# EAGLE design pc_kalam_ads1220_cap (EAGLE 6.4)
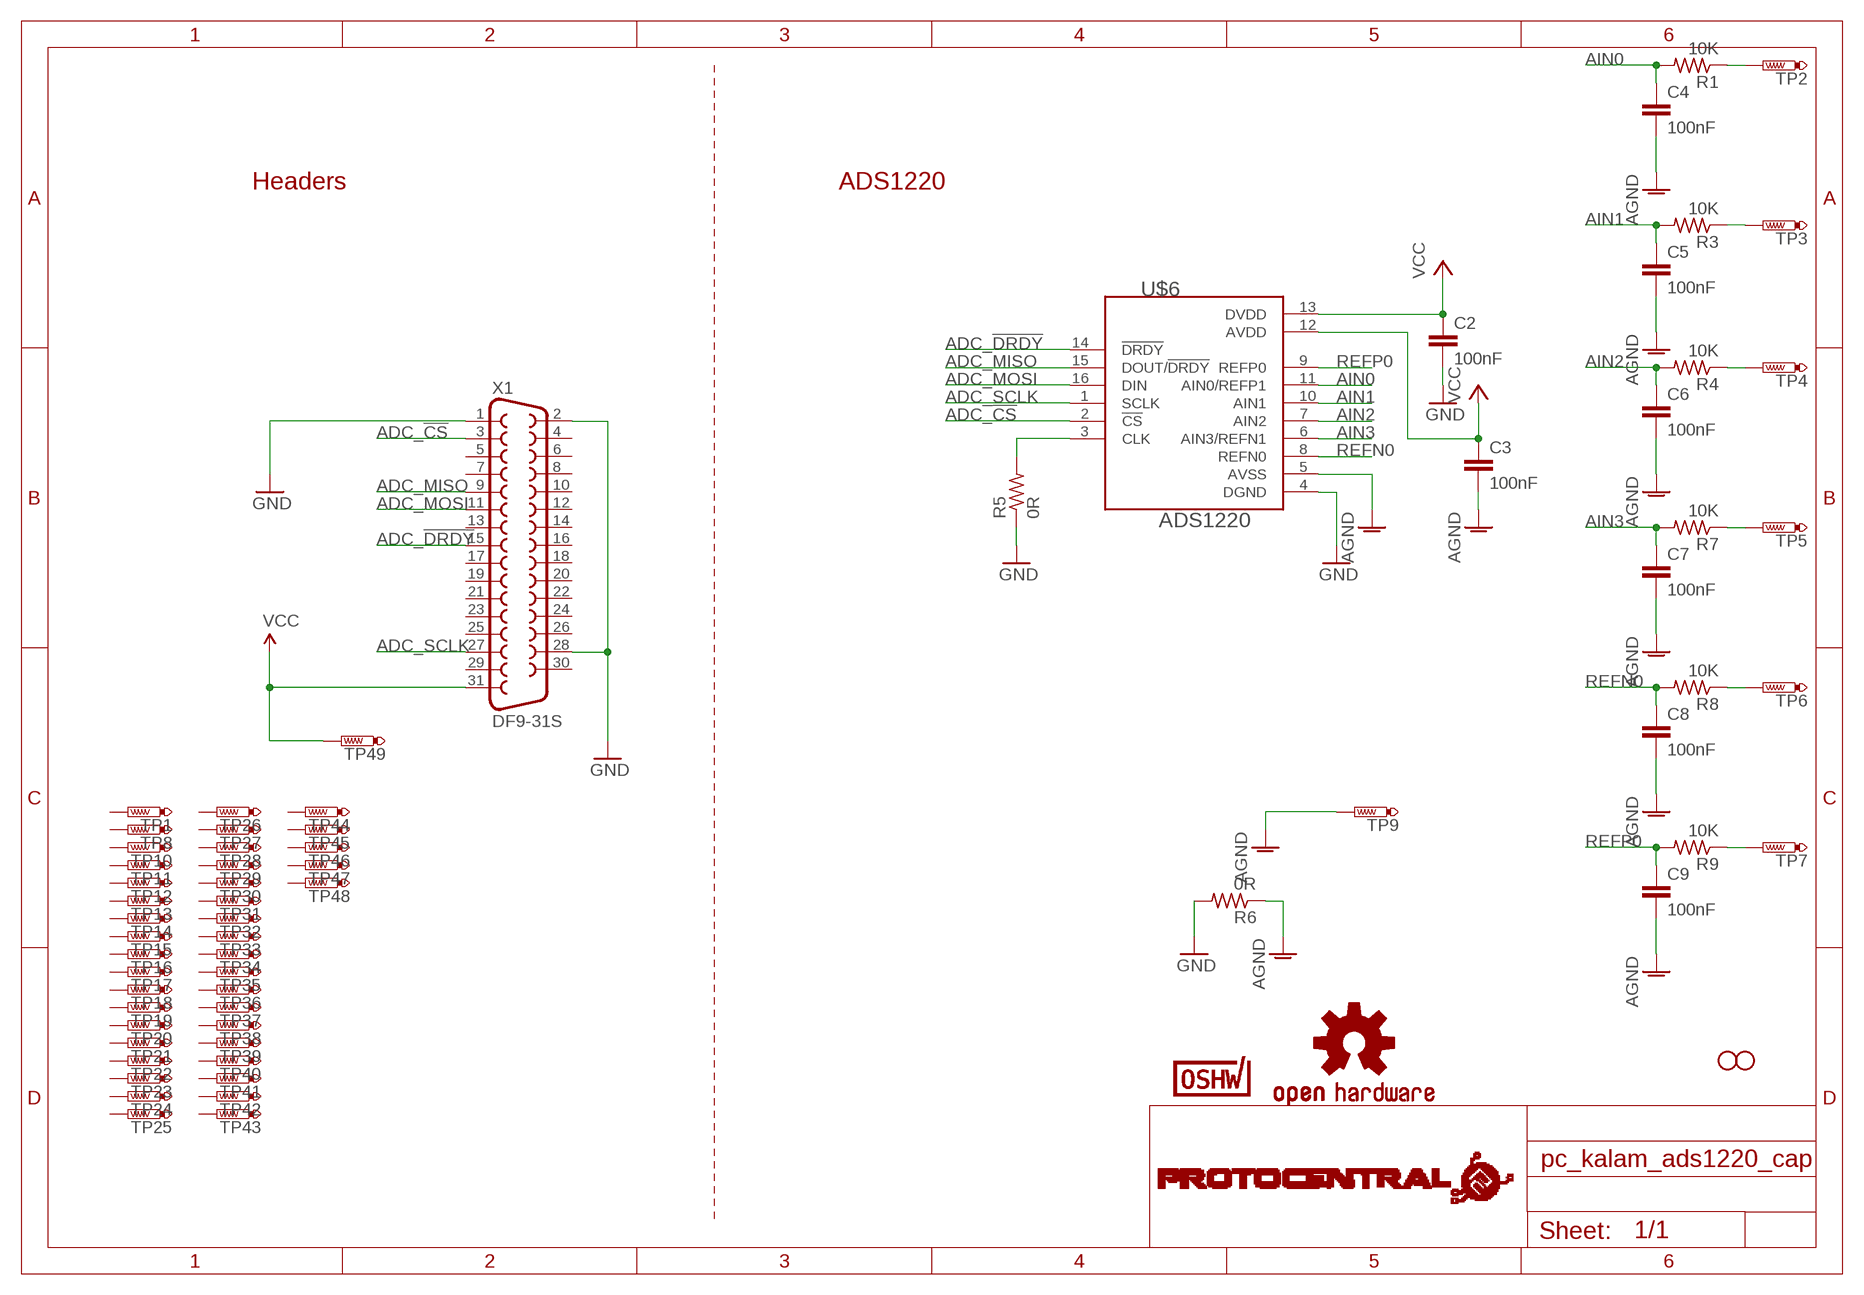
[diagram p0: schematic, sheet 1]

## Parts
C2  100nF  C-EUC0805  [C0805]
C3  100nF  C-EUC0805  [C0805]
C4  100nF  C-EUC0805  [C0805]
C5  100nF  C-EUC0805  [C0805]
C6  100nF  C-EUC0805  [C0805]
C7  100nF  C-EUC0805  [C0805]
C8  100nF  C-EUC0805  [C0805]
C9  100nF  C-EUC0805  [C0805]
R1  10K  R-US_R0805  [R0805]
R3  10K  R-US_R0805  [R0805]
R4  10K  R-US_R0805  [R0805]
R5  0R  R-US_R0805  [R0805]
R6  0R  R-US_R0805  [R0805]
R7  10K  R-US_R0805  [R0805]
R8  10K  R-US_R0805  [R0805]
R9  10K  R-US_R0805  [R0805]
STANDOFF7  STAND-OFF  [STAND-OFF]
STANDOFF8  STAND-OFF  [STAND-OFF]
TP1  PTR1PAD1-13  [P1-13]
TP2  PTR1PAD1-13  [P1-13]
TP3  PTR1PAD1-13  [P1-13]
TP4  PTR1PAD1-13  [P1-13]
TP5  PTR1PAD1-13  [P1-13]
TP6  PTR1PAD1-13  [P1-13]
TP7  PTR1PAD1-13  [P1-13]
TP8  PTR1PAD1-13  [P1-13]
TP9  PTR1PAD1-13  [P1-13]
TP10  PTR1PAD1-13  [P1-13]
TP11  PTR1PAD1-13  [P1-13]
TP12  PTR1PAD1-13  [P1-13]
TP13  PTR1PAD1-13  [P1-13]
TP14  PTR1PAD1-13  [P1-13]
TP15  PTR1PAD1-13  [P1-13]
TP16  PTR1PAD1-13  [P1-13]
TP17  PTR1PAD1-13  [P1-13]
TP18  PTR1PAD1-13  [P1-13]
TP19  PTR1PAD1-13  [P1-13]
TP20  PTR1PAD1-13  [P1-13]
TP21  PTR1PAD1-13  [P1-13]
TP22  PTR1PAD1-13  [P1-13]
TP23  PTR1PAD1-13  [P1-13]
TP24  PTR1PAD1-13  [P1-13]
TP25  PTR1PAD1-13  [P1-13]
TP26  PTR1PAD1-13  [P1-13]
TP27  PTR1PAD1-13  [P1-13]
TP28  PTR1PAD1-13  [P1-13]
TP29  PTR1PAD1-13  [P1-13]
TP30  PTR1PAD1-13  [P1-13]
TP31  PTR1PAD1-13  [P1-13]
TP32  PTR1PAD1-13  [P1-13]
TP33  PTR1PAD1-13  [P1-13]
TP34  PTR1PAD1-13  [P1-13]
TP35  PTR1PAD1-13  [P1-13]
TP36  PTR1PAD1-13  [P1-13]
TP37  PTR1PAD1-13  [P1-13]
TP38  PTR1PAD1-13  [P1-13]
TP39  PTR1PAD1-13  [P1-13]
TP40  PTR1PAD1-13  [P1-13]
TP41  PTR1PAD1-13  [P1-13]
TP42  PTR1PAD1-13  [P1-13]
TP43  PTR1PAD1-13  [P1-13]
TP44  PTR1PAD1-13  [P1-13]
TP45  PTR1PAD1-13  [P1-13]
TP46  PTR1PAD1-13  [P1-13]
TP47  PTR1PAD1-13  [P1-13]
TP48  PTR1PAD1-13  [P1-13]
TP49  PTR1PAD1-13  [P1-13]
U$1  PROTY-LOGO  [LOGO-PROTY]
U$2  CERT-SMALL  [CERT-SMALL-SILK]
U$3  OSHW-LOGOS  [OSHW-LOGO-S]
U$6  ADS1220  [TSSOP-16]
X1  DF9-31S  [DF9-31S]

## Nets
ADC_!CS: U$6.2(!CS) X1.3
ADC_!DRDY: U$6.14(!DRDY) X1.15
ADC_CLK: R5.2 U$6.3(CLK)
ADC_MISO: U$6.15(DOUT/!DRDY) X1.9
ADC_MOSI: U$6.16(DIN) X1.11
ADC_SCLK: U$6.1(SCLK) X1.27
AGND: C3.2 C4.2 C5.2 C6.2 C7.2 C8.2 C9.2 R6.1 TP9.TP U$6.5(AVSS)
AIN0: C4.1 R1.2 U$6.11(AIN0/REFP1)
AIN1: C5.1 R3.2 U$6.10(AIN1)
AIN2: C6.1 R4.2 U$6.7(AIN2)
AIN3: C7.1 R7.2 U$6.6(AIN3/REFN1)
GND: C2.2 R5.1 R6.2 U$6.4(DGND) X1.1 X1.2 X1.28
N$2: R1.1 TP2.TP
N$3: R3.1 TP3.TP
N$4: R4.1 TP4.TP
N$5: R7.1 TP5.TP
N$6: R8.1 TP6.TP
N$7: R9.1 TP7.TP
REFN0: C8.1 R8.2 U$6.8(REFN0)
REFP0: C9.1 R9.2 U$6.9(REFP0)
VCC: C2.1 C3.1 TP49.TP U$6.12(AVDD) U$6.13(DVDD) X1.31
Unconnected: TP1.TP TP8.TP TP10.TP TP11.TP TP12.TP TP13.TP TP14.TP TP15.TP TP16.TP TP17.TP TP18.TP TP19.TP TP20.TP TP21.TP TP22.TP TP23.TP TP24.TP TP25.TP TP26.TP TP27.TP TP28.TP TP29.TP TP30.TP TP31.TP TP32.TP TP33.TP TP34.TP TP35.TP TP36.TP TP37.TP TP38.TP TP39.TP TP40.TP TP41.TP TP42.TP TP43.TP TP44.TP TP45.TP TP46.TP TP47.TP TP48.TP X1.4 X1.5 X1.6 X1.7 X1.8 X1.10 X1.12 X1.13 X1.14 X1.16 X1.17 X1.18 X1.19 X1.20 X1.21 X1.22 X1.23 X1.24 X1.25 X1.26 X1.29 X1.30

## Notes on the sheet
- Headers | ADS1220

## Library data of the parts
C2-C9 = rcl:C-EU: CAPACITOR, European symbol
R1 R3-R9 = rcl:R-US_: RESISTOR, American symbol
STANDOFF7 STANDOFF8 = SparkFun-Electromechanical:STAND-OFF: #4 Stand Off This is the mechanical footprint for a #4 phillips button head screw. Use the keepout ring to avoid running the screw head into surrounding components. SKU : PRT-00447
TP1-TP49 = testpad:PTR1: TEST PIN
U$1 = circuitects:PROTY-LOGO
U$2 = OSHWA:CERT
U$3 = SparkFun:OSHW-LOGO: Open Source Hardware Logo This logo indicates the piece of hardware it is found on incorporates a OSHW license and/or adheres to the definition of open source hardware found here: http://freedomdefined.org/OSHW
U$6 = circuitects:ADS1220
X1 = con-hirose:DF9-31S: SMD CONNECTOR Source: con-hirose.lbr from Bob Starr <rtzaudio@mindspring.com>; MPN: DF9-31S-1V(32); OC_FARNELL: 1798382; OC_NEWARK: 74R3383

## Board
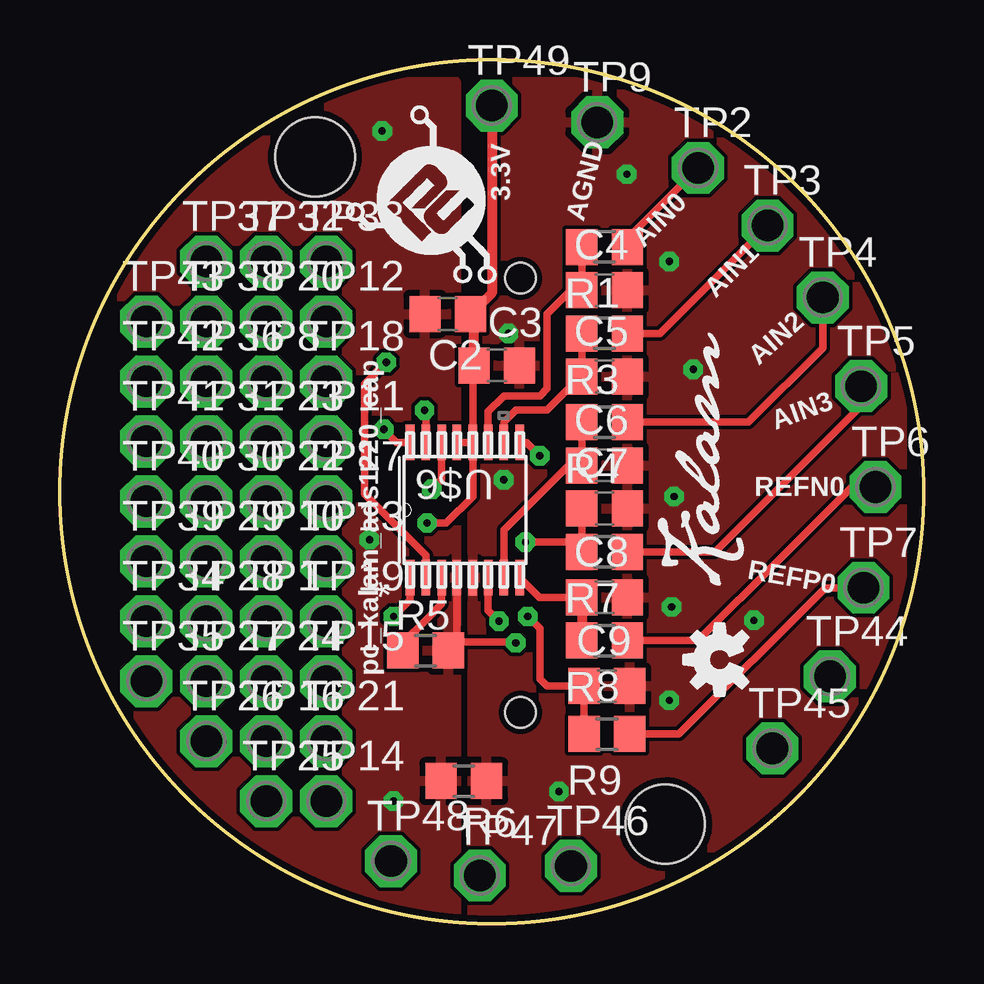
[diagram p1: board, top side]
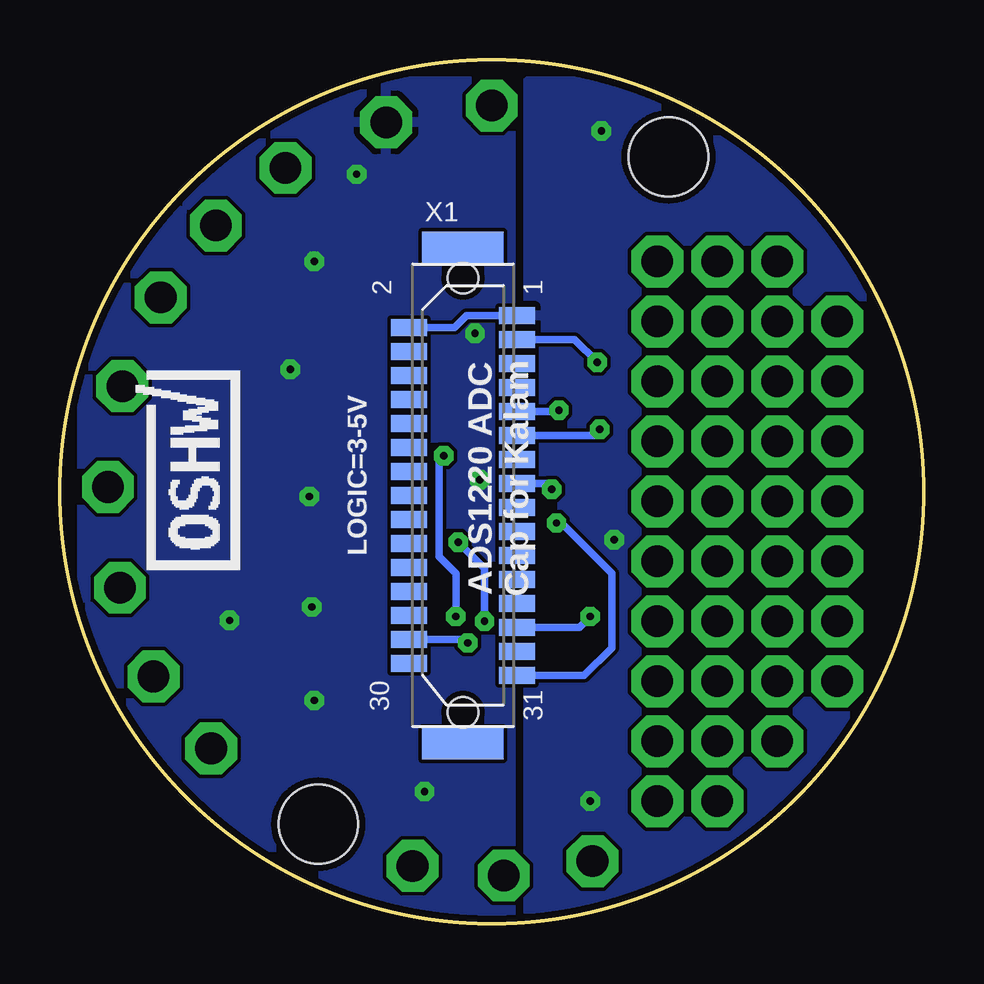
[diagram p2: board, bottom side, seen from below]

Size 36 x 36 mm. Coordinates in mm from the lower left corner, seen from the top.
Outline: circle at 18,18 radius 18
Copper layers (1*2*15*16): Top 0.035mm / dielectric 1.5mm / Route2 0.035mm / dielectric 0.15mm / Route15 0.035mm / dielectric 0.2mm / Bottom 0.035mm
Design rules "Circuitects-Rules": minimum track width 6mil, minimum drill 0.3mm, track to track 6mil, track to pad 6mil, pad to pad 6mil, via to via 6mil, smd to smd 6mil, copper to edge 10mil, drill to drill 8mil, minimum pad ring 12mil, minimum via ring 10mil, stop-mask expansion 4mil, vias tented up to drill 25mil, thermal gap 10mil

### Footprints (pad centres in the part's own frame; a part is rotated, then mirrored left to right if it is on the bottom)
C0805 = smd 1.3 x 1.5: 1 -0.95,0; 2 0.95,0
R0805 = smd 1.3 x 1.5: 1 -0.95,0; 2 0.95,0
STAND-OFF = hole 3.302: 0,0
P1-13 = drill 1.321 pad 2.159 octagon: TP 0,0
TSSOP-16 = smd 1.473 x 0.356: 1 -2.819,2.256; 2 -2.819,1.596; 3 -2.819,0.935; 4 -2.819,0.3; 5 -2.819,-0.36; 6 -2.819,-0.995; 7 -2.819,-1.656; 8 -2.819,-2.316; 9 2.819,-2.316; 10 2.819,-1.656; 11 2.819,-0.995; 12 2.819,-0.36; 13 2.819,0.3; 14 2.819,0.935; 15 2.819,1.596; 16 2.819,2.256
DF9-31S = smd 0.7 x 1.5: 1 -7.5,2.25; 2 -7,-2.25; 3 -6.5,2.25; 4 -6,-2.25; 5 -5.5,2.25; 6 -5,-2.25; 7 -4.5,2.25; 8 -4,-2.25; 9 -3.5,2.25; 10 -3,-2.25; 11 -2.5,2.25; 12 -2,-2.25; 13 -1.5,2.25; 14 -1,-2.25; 15 -0.5,2.25; 16 0,-2.25; 17 0.5,2.25; 18 1,-2.25; 19 1.5,2.25; 20 2,-2.25; 21 2.5,2.25; 22 3,-2.25; 23 3.5,2.25; 24 4,-2.25; 25 4.5,2.25; 26 5,-2.25; 27 5.5,2.25; 28 6,-2.25; 29 6.5,2.25; 30 7,-2.25; 31 7.5,2.25 | smd 1.3 x 3.4: M1 -10.35,0; M2 10.35,0 | hole 1.27: 9.05,0; -9.05,0

### Placement (x,y rotation side)
C2  16.17,25.41 180 top
C3  18.21,23.27 0 top
C4  22.7,26.4 0 top
C5  22.7,22.8 0 top
C6  22.7,19.1 0 top
C7  22.7,17.3 0 top
C8  22.7,13.6 0 top
C9  22.8,9.9 0 top
R1  22.7,28.2 180 top
R3  22.7,24.6 180 top
R4  22.7,20.9 180 top
R5  15.24,11.38 180 top
R6  16.83,5.94 180 top
R7  22.7,15.5 180 top
R8  22.7,11.8 180 top
R9  22.8,7.9 180 top
STANDOFF7  10.64,31.96 0 bottom
STANDOFF8  25.24,4.14 0 bottom
TP1  8.6,12.6 0 top
TP2  26.6,31.5 0 top
TP3  29.5,29.1 0 top
TP4  31.8,26.1 0 top
TP5  33.4,22.4 0 top
TP6  34,18.2 0 top
TP7  33.5,14 0 top
TP8  8.6,22.6 0 top
TP9  22.4,33.4 0 top
TP10  8.6,15.1 0 top
TP11  11.1,20.1 0 top
TP12  11.1,25.1 0 top
TP13  11.1,15.1 0 top
TP14  11.1,5.1 0 top
TP15  11.1,10.1 0 top
TP16  8.6,7.6 0 top
TP17  11.1,17.6 0 top
TP18  11.1,22.6 0 top
TP19  11.1,12.6 0 top
TP20  8.6,25.1 0 top
TP21  11.1,7.6 0 top
TP22  8.6,17.6 0 top
TP23  8.6,20.1 0 top
TP24  8.6,10.1 0 top
TP25  8.6,5.1 0 top
TP26  6.1,7.6 0 top
TP27  6.1,10.1 0 top
TP28  6.1,12.6 0 top
TP29  6.1,15.1 0 top
TP30  6.1,17.6 0 top
TP31  6.1,20.1 0 top
TP32  8.6,27.6 0 top
TP33  11.1,27.6 0 top
TP34  3.6,12.6 0 top
TP35  3.6,10.1 0 top
TP36  6.1,22.6 0 top
TP37  6.1,27.6 0 top
TP38  6.1,25.1 0 top
TP39  3.6,15.1 0 top
TP40  3.6,17.6 0 top
TP41  3.6,20.1 0 top
TP42  3.6,22.6 0 top
TP43  3.6,25.1 0 top
TP44  32.1,10.3 0 top
TP45  29.7,7.3 0 top
TP46  21.3,2.4 0 top
TP47  17.5,2 0 top
TP48  13.8,2.6 0 top
TP49  18,34.1 0 top
U$1  18.3,26.6 90 top
U$2  28.5,18.9 90 bottom
U$3  27.5,11 90 top
U$4  [KALAM-NAME-ONLY]  28.5,14 90 top
U$6  16.85,17.24 90 top
X1  19.2,17.85 270 bottom

### Tracks (layer width: path | path; a pad name or v marks a point on that pad's centre or on a via)
ADC_!CS  (via drill 0.3)
  Top 0.305: v13.6,23.4 12.7,22.5 12.7,17.9 15.25,15.35 U$6.2
  Bottom 0.305: X1.3 14.55,24.35 v13.6,23.4
ADC_!DRDY  (via drill 0.3)
  Top 0.305: U$6.14 15.92,18.52 v15.5,18.1
  Bottom 0.305: X1.15 15.75,18.35 v15.5,18.1
ADC_CLK
  Top 0.305: U$6.3 15.92,13.32 15.4,12.8 15.3,12.7 14.29,11.69 R5.2
ADC_MISO  (via drill 0.3)
  Top 0.305: U$6.15 15.25,21.35 v15.2,21.4
  Bottom 0.305: X1.9 15.25,21.35 v15.2,21.4
ADC_MOSI  (via drill 0.3)
  Top 0.305: U$6.16 14.04,20.06 v13.5,20.6
  Bottom 0.305: X1.11 13.75,20.35 v13.5,20.6
ADC_SCLK  (via drill 0.3)
  Top 0.305: U$6.1 14.59,13.49 v13.9,12.8
  Bottom 0.305: X1.27 14.35,12.35 v13.9,12.8
AGND  (via drill 0.3)
  other vias: 23.63,31.24 28.93,12.64 26.4,23.1 20.8,5.5 18.7,24.6 25.5,13.2 25.6,17.8 25.4,9.3 25.4,27.6 18.5,18.5
  pour Bottom: 17.2,35.1 35.1,35.1 35.1,-1.9 17.2,-1.9
  pour Top: 17.2,35.1 35.1,35.1 35.1,-1.9 17.2,-1.9
AIN0
  Top 0.305: U$6.11 17.85,21.35 18.5,22 20,22 20.3,22.3 20.3,25.4 21.3,26.4 C4.1 R1.2
AIN1
  Top 0.305: U$6.10 18.51,20.91 19,21.4 20.3,21.4 21.7,22.8 C5.1 R3.2
AIN2
  Top 0.305: R4.2 C6.1 21.2,19.1 18.51,16.41 U$6.7
AIN3  (via drill 0.3)
  Top 0.305: U$6.6 17.85,13.06 v18.3,12.6 | v19.4,15.9 21.35,15.9 R7.2 C7.1
  Bottom 0.305: v18.3,12.6 18.3,14.8 v19.4,15.9
GND  (via drill 0.3)
  Top 0.305: U$6.4 16.55,11.74 | 16.55,11.74 R5.1 | 16.55,11.74 18.96,11.74 v19,11.7
  Bottom 0.305: X1.2 19.55,24.85 19.05,25.35 X1.1 | X1.28 19.15,11.85 v19,11.7
  other vias: 13.9,5.1 13.43,33.04 12.9,16
  pour Top: -0.9,35.1 16.5,35.1 16.5,-1.9 -0.9,-1.9
  pour Bottom: -0.9,35.1 16.5,35.1 16.5,-1.9 -0.9,-1.9
N$2
  Top 0.305: R1.1 23.65,28.55 TP2.TP
N$3
  Top 0.305: R3.1 25,24.6 TP3.TP
N$4
  Top 0.305: R4.1 28.7,20.9 31.8,24 TP4.TP
N$5
  Top 0.305: R7.1 27.3,15.5 33.4,21.6 TP5.TP
N$6
  Top 0.305: R8.1 26.6,11.8 30.05,15.25 30.4,15.6 33,18.2 TP6.TP
N$7
  Top 0.305: R9.1 25.8,7.9 31.9,14 TP7.TP
REFN0
  Top 0.305: C8.1 19.99,13.6 U$6.8
  Top 0.406: C8.1 R8.2
REFP0  (via drill 0.3)
  Top 0.305: R9.2 C9.1 20.3,9.9 20,10.2 20,12.3 v19.5,12.8 | U$6.9 19.44,20.06 v20,19.5
  Bottom 0.305: v19.5,12.8 19.5,14.6 20.2,15.3 20.2,19.3 v20,19.5
VCC  (via drill 0.3)
  Top 0.305: U$6.13 U$6.12 | U$6.12 17.21,23.22 C3.1 | U$6.12 17.21,17.81 16.1,16.7 v15.3,16.7
  Top 0.406: C3.1 17.26,25.07 C2.1 18,26.29 TP49.TP
  Bottom 0.305: v15.3,16.7 15.1,16.7 13,14.6 13,11.5 14.15,10.35 X1.31

### Text on the board
tPlace: 3.3V | AGND | AIN0 | AIN1 | AIN2 | AIN3 | REFN0 | REFP0 | pc_kalam_ads1220_cap
bPlace: LOGIC=3-5V | ADS1220 ADC / Cap for Kalam